# Altium project STM_BLUEPILL.PrjPcb
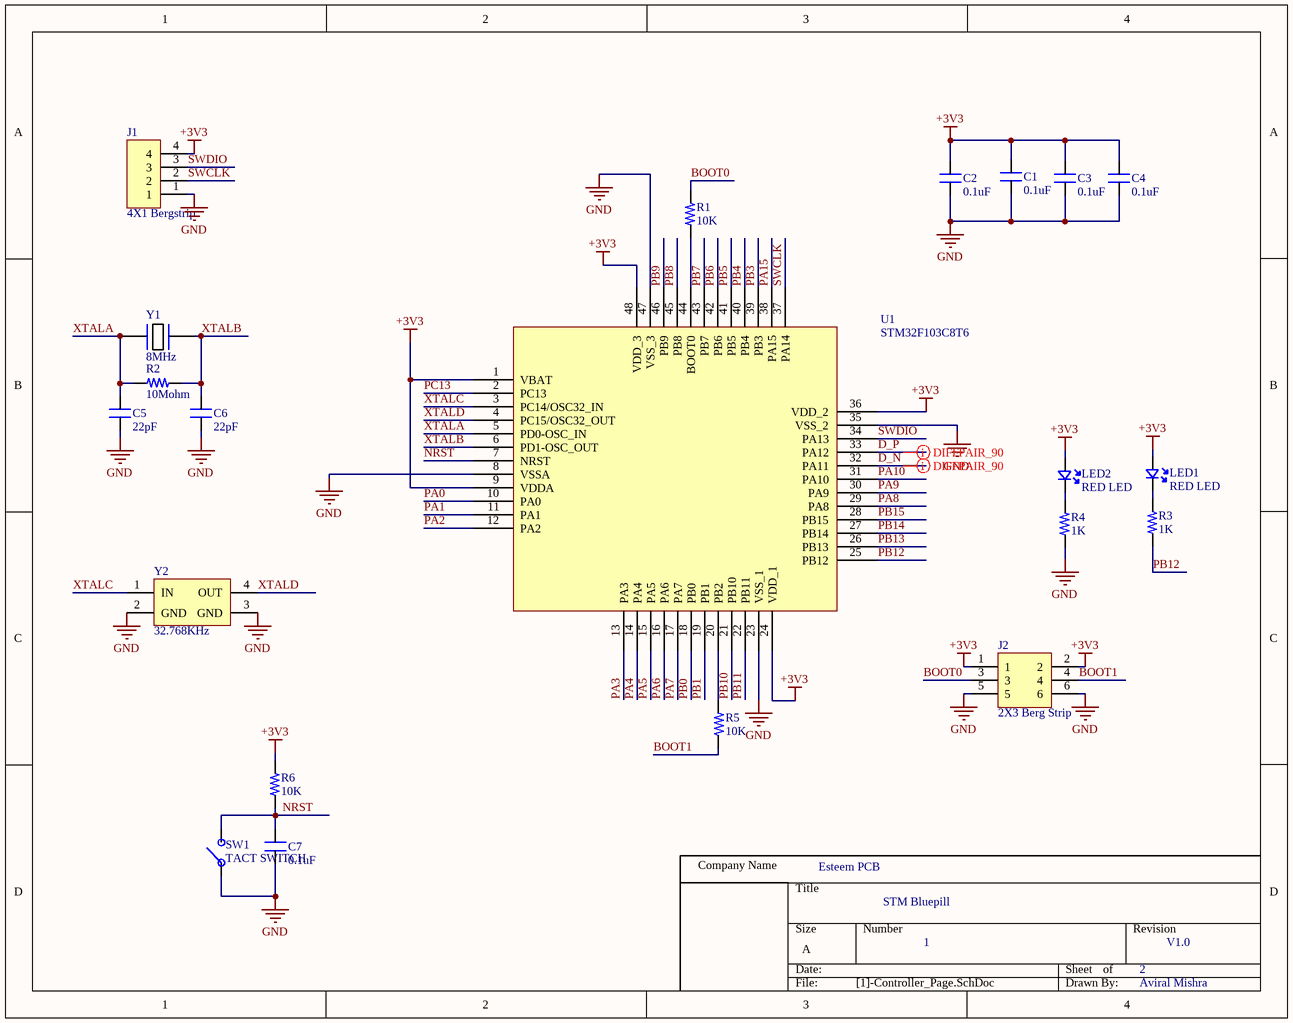
[diagram p0: [1]-Controller_Page.SchDoc]
2 sheets, 30 parts. Net scope: global (net labels, ports and power ports of the same name join across sheets).
Board file: STM_BLUEPILL.PcbDoc
Sheets:
  [1]-Controller_Page.SchDoc
  [2]- Connector_Page.SchDoc

## Sheet [1]-Controller_Page.SchDoc: STM Bluepill
size A; DrawnBy: Aviral Mishra; DocumentNumber: 1; Revision: V1.0; SheetNumber: 1; SheetTotal: 2; Company Name: Esteem PCB

### Parts
C1  0.1uF  [CAP_0805]
C2  0.1uF  [CAP_0805]
C3  0.1uF  [CAP_0805]
C4  0.1uF  [CAP_0805]
C5  22pF  [CAP_0805]
C6  22pF  [CAP_0805]
C7  0.1uF  [CAP_0805]
J1  4X1 Bergstrip  [CON4_100_40D72_TH_ST_MALE]
J2  2X3 Berg Strip  [CON6_100_59D78_TH_ST_Duplicate]
LED1  RED LED  [LED_0805]
LED2  RED LED  [LED_0805]
R1  10K  [RES_0805]
R2  10Mohm  [RES_0805]
R3  1K  [RES_0805]
R4  1K  [RES_0805]
R5  10K  [RES_0805]
R6  10K  [RES_0805]
SW1  TACT SWITCH  [SW_342_SMD]
U1  STM32F103C8T6  [LQFP-48_19.6_393_58X11_SMD]
Y1  8MHz  [XTAL_314_240X47_SMD]
Y2  32.768KHz  [XTAL_MC-405 32.7680K-G3]

### Nets
+3V3: C1.2 C2.2 C3.2 C4.2 J1.4 J2.1 J2.2 LED1.A LED2.A R6.2 U1.1(VBAT) U1.9(VDDA) U1.24(VDD_1) U1.36(VDD_2) U1.48(VDD_3)
GND: C1.1 C2.1 C3.1 C4.1 C5.1 C6.1 C7.1 J1.1 J2.5 J2.6 R4.1 SW1.1 U1.8(VSSA) U1.23(VSS_1) U1.35(VSS_2) U1.47(VSS_3) Y2.2(GND) Y2.3(GND)
BOOT0: J2.3 R1.2
BOOT1: J2.4 R5.2
D_N: U1.32(PA11)
D_P: U1.33(PA12)
NRST: C7.2 R6.1 SW1.2 U1.7(NRST)
PA0: U1.10(PA0)
PA1: U1.11(PA1)
PA2: U1.12(PA2)
PA3: U1.13(PA3)
PA4: U1.14(PA4)
PA5: U1.15(PA5)
PA6: U1.16(PA6)
PA7: U1.17(PA7)
PA8: U1.29(PA8)
PA9: U1.30(PA9)
PA10: U1.31(PA10)
PA15: U1.38(PA15)
PB0: U1.18(PB0)
PB1: U1.19(PB1)
PB3: U1.39(PB3)
PB4: U1.40(PB4)
PB5: U1.41(PB5)
PB6: U1.42(PB6)
PB7: U1.43(PB7)
PB8: U1.45(PB8)
PB9: U1.46(PB9)
PB10: U1.21(PB10)
PB11: U1.22(PB11)
PB12: R3.1 U1.25(PB12)
PB13: U1.26(PB13)
PB14: U1.27(PB14)
PB15: U1.28(PB15)
PC13: U1.2(PC13)
SWCLK: J1.2 U1.37(PA14)
SWDIO: J1.3 U1.34(PA13)
XTALA: C5.2 R2.1 U1.5(PD0-OSC_IN) Y1.1
XTALB: C6.2 R2.2 U1.6(PD1-OSC_OUT) Y1.2
XTALC: U1.3(PC14/OSC32_IN) Y2.1(IN)
XTALD: U1.4(PC15/OSC32_OUT) Y2.4(OUT)
NetLED1_K: LED1.K R3.2
NetLED2_K: LED2.K R4.2
NetR1_1: R1.1 U1.44(BOOT0)
NetR5_1: R5.1 U1.20(PB2)

### Layout directives
differential pair; Diff.Pair Net Class: diff_90: D_N, D_P

### Notes on the sheet
- Company Name

### Library data of the parts
C1-C4 C7 = CAP_0.1uF-50V-5%-0805: 0.1µF ±5% 50V Ceramic Capacitor X7R 0805 (2012 Metric); Manufacturer: KEMET; Manufacturing Part Number: C0805C104J5RACTU; Case/Package: 0805 (2012 Metric); Supplier-1: Digikey; Supplier Part Number-1: 399-1171-1-ND
C5 C6 = CAP_22pF-50V-5%-0805: 22pF ±5% 50V Ceramic Capacitor C0G, NP0 0805 (2012 Metric); Manufacturer: KEMET; Manufacturer Part Number: C0805C220J5GACTU; Case/Package: 0805; Supplier-1: Digikey; Supplier Part Number-1: 399-1113-1-ND
J1 = CON-BS-PLG_4X1-100-TH-ST: 4 pin, 1 row, 2.54mm pitch bergstrip; Manufacturer: NA; Manufacturing Part Number: NA; Case/Package: TH; Supplier-1: NA; Supplier Part Number-1: NA
J2 = CON-BS-PLG_2X3-100-TH-ST: 6 pin, 2 row, 2.54mm pitch bergstrip; Manufacturer: NA; Manufacturer Part Number: NA; Case/Package: TH; Supplier-1: NA; Supplier Part Number-1: NA
LED1 LED2 = LED-RED_10mA-0805: Red 621nm LED Indication - Discrete 2V 0805 (2012 Metric); Manufacturer: Lite-On Inc.; Manufacturer Part Number: LTST-C170EKT; Case/ Package: 0805; Supplier-1: Digikey; Supplier Part Number-1: 160-1178-1-ND
R1 R5 R6 = RES_10K-0.125W-1%-0805: 10 kOhms ±1% 0.125W, 1/8W Chip Resistor 0805 (2012 Metric) Moisture Resistant Thick Film; Manufacturer: Yageo; Manufacturing Part Number: RC0805FR-0710KL; Case/Package: 0805; Supplier-1: Digikey; Supplier Part Number-1: 311-10.0KCRCT-ND
R2 = RES_10MOHM-0.125W-1%-0805: 10 MOhms ±1% 0.125W, 1/8W Chip Resistor 0805 (2012 Metric) Automotive AEC-Q200, High Voltage Thick Film; Manufacturer: Rohm Semiconductor; Manufacturing Part Number: KTR10EZPF1005; Case/Package: 0805 (2012 Metric); Supplier-1: Digikey; Supplier Part Number-1: RHM10.0MAHCT-ND
R3 R4 = RES_1K-0.125W-1%-0805: 1 kOhms ±1% 0.125W, 1/8W Chip Resistor 0805 (2012 Metric) Moisture Resistant Thick Film; Manufacturer: ??á; Manufacturer Part Number: RC0805FR-071KL; Case/Package: 0805; Supplier-1: Digikey; Supplier Part Number-1: 311-1.00KCRCT-ND
SW1 = SW_KSR223GLFG-SMD: Tactile Switch SPST-NO Top Actuated Surface Mount; Manufacturer: C&K; Manufacturing Part Number: KSR223GLFG; Case/Package: SMD; Supplier-1: Digikey; Supplier Part Number-1: 401-1704-1-ND
U1 = IC-STM32F103C8T6 _1: ARM® Cortex®-M3 STM32F1 Microcontroller IC 32-Bit 72MHz 64KB (64K x 8) FLASH; Manufacturer: STMicroelectronics; Manufacturer Part Number: STM32F103C8T6; Case/Package: 48-LQFP; Supplier-1: Digikey; Supplier Part Number-1: 497-6063-ND
Y1 = XTAL_8MHZ-LFXTAL030234: Crystals 8MHz 22pF -20C 70C; Manufacturer: IQD Frequency Products; Manufacturing Part Number: LFXTAL030234Reel; Case/Package: SMD; Supplier-1: Mouser; Supplier Part Number-1: 449-LFXTAL030234REEL
Y2 = XTAL_32.768KHz-MC-405 32.7680K-G3: Crystals SMD AT XTL MHZ +/-50PPM 12.5 PF 250 T/R; Manufacturer: Epson; Manufacturing Part Number: MC-405 32.7680K-G3: ROHS; Case/Package: SMD; Supplier-1: Mouser; Supplier Part Number-1: 732-MC405327680KG3RS

## Sheet [2]- Connector_Page.SchDoc: STM Bluepill
size A; DrawnBy: Aviral Mishra; DocumentNumber: 2; Revision: V1.0; SheetNumber: 2; SheetTotal: 2; Company Name: Esteem PCB
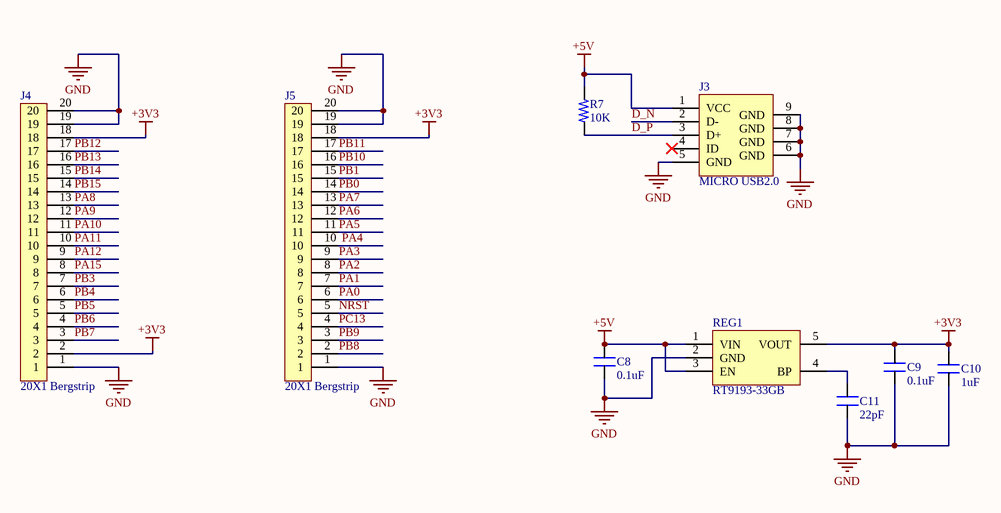
[diagram p1: [2]- Connector_Page.SchDoc]

### Parts
C8  0.1uF  [CAP_0805]
C9  0.1uF  [CAP_0805]
C10  1uF  [CAP_0805]
C11  22pF  [CAP_0805]
J3  MICRO USB2.0  [CON_10118192-0001LF_SMD]
J4  20X1 Bergstrip  [CON20_100_40D72_TH_ST]
J5  20X1 Bergstrip  [CON20_100_40D72_TH_ST]
R7  10K  [RES_0805]
REG1  RT9193-33GB  [SOT23-5]

### Nets
+3V3: C9.2 C10.2 J4.2 J4.18 J5.18 REG1.5(VOUT)
+5V: C8.2 J3.1(VCC) R7.2 REG1.1(VIN) REG1.3(EN)
GND: C8.1 C9.1 C10.1 C11.1 J3.5(GND) J3.6(GND) J3.7(GND) J3.8(GND) J3.9(GND) J4.1 J4.19 J4.20 J5.1 J5.19 J5.20 REG1.2(GND)
D_N: J3.2(D-)
D_P: J3.3(D+) R7.1
NRST: J5.5
PA0: J5.6
PA1: J5.7
PA2: J5.8
PA3: J5.9
PA4: J5.10
PA5: J5.11
PA6: J5.12
PA7: J5.13
PA8: J4.13
PA9: J4.12
PA10: J4.11
PA11: J4.10
PA12: J4.9
PA15: J4.8
PB0: J5.14
PB1: J5.15
PB3: J4.7
PB4: J4.6
PB5: J4.5
PB6: J4.4
PB7: J4.3
PB8: J5.2
PB9: J5.3
PB10: J5.16
PB11: J5.17
PB12: J4.17
PB13: J4.16
PB14: J4.15
PB15: J4.14
PC13: J5.4
NetC11_2: C11.2 REG1.4(BP)

Not connected (* = marked no-connect by the designer): J3 4(ID)*

### Notes on the sheet
- Company Name

### Library data of the parts
C8 C9 = CAP_0.1uF-50V-5%-0805: as C1 on sheet [1]-Controller_Page; Case/Package: 0805 (2012 Metric); Supplier-1: Digikey; Supplier Part Number-1: 399-1171-1-ND
C10 = CAP_1uF-50V-5%-0805: 1µF ±5% 50V Ceramic Capacitor X7R 0805 (2012 Metric); Manufacturer: Yageo; Manufacturing Part Number: CC0805JKX7R9BB105; Case/Package: 0805 (2012 Metric); Supplier-1: Digikey; Supplier Part Number-1: 311-3498-1-ND
C11 = CAP_22pF-50V-5%-0805: as C5 on sheet [1]-Controller_Page; Case/Package: 0805; Supplier-1: Digikey; Supplier Part Number-1: 399-1113-1-ND
J3 = CON-USB_10118192-0002LF-SMD: USB - micro B USB 2.0 Receptacle Connector 5 Position Surface Mount, Right Angle; Manufacturer: Amphenol ICC (FCI); Manufacturing Part Number: 10118192-0002LF; Case/Package: SMD; Supplier-1: Digikey; Supplier Part Number-1: 609-5379-1-ND
J4 J5 = CON-BS-PLG_20X1-100-TH-ST: 20 pin, 1 row, 2.54mm pitch bergstrip; Manufacturer: NA; Manufacturing Part Number: NA; Case/Package: TH; Supplier-1: NA; Supplier Part Number-1: NA
R7 = RES_10K-0.125W-1%-0805: as R1 on sheet [1]-Controller_Page; Case/Package: 0805; Supplier-1: Digikey; Supplier Part Number-1: 311-10.0KCRCT-ND
REG1 = REG_3.3V-5.5V-0.3A-SOT-23-5: Linear Voltage Regulator IC 1 Output 300mA SOT-23-5; Manufacturer: Richtek USA Inc.; Manufacturer Part Number: RT9193-33GB; Case/ Package: SOT-23-5; Supplier-1: Digikey; Supplier Part Number-1: 1028-1014-1-ND

## Nets that join several sheets
+3V3: [1]-Controller_Page (15 pins), [2]- Connector_Page (6 pins)
GND: [1]-Controller_Page (18 pins), [2]- Connector_Page (16 pins)
D_N: [1]-Controller_Page (U1.32), [2]- Connector_Page (J3.2)
D_P: [1]-Controller_Page (U1.33), [2]- Connector_Page (J3.3 R7.1)
NRST: [1]-Controller_Page (C7.2 R6.1 SW1.2 U1.7), [2]- Connector_Page (J5.5)
PA0: [1]-Controller_Page (U1.10), [2]- Connector_Page (J5.6)
PA1: [1]-Controller_Page (U1.11), [2]- Connector_Page (J5.7)
PA2: [1]-Controller_Page (U1.12), [2]- Connector_Page (J5.8)
PA3: [1]-Controller_Page (U1.13), [2]- Connector_Page (J5.9)
PA4: [1]-Controller_Page (U1.14), [2]- Connector_Page (J5.10)
PA5: [1]-Controller_Page (U1.15), [2]- Connector_Page (J5.11)
PA6: [1]-Controller_Page (U1.16), [2]- Connector_Page (J5.12)
PA7: [1]-Controller_Page (U1.17), [2]- Connector_Page (J5.13)
PA8: [1]-Controller_Page (U1.29), [2]- Connector_Page (J4.13)
PA9: [1]-Controller_Page (U1.30), [2]- Connector_Page (J4.12)
PA10: [1]-Controller_Page (U1.31), [2]- Connector_Page (J4.11)
PA15: [1]-Controller_Page (U1.38), [2]- Connector_Page (J4.8)
PB0: [1]-Controller_Page (U1.18), [2]- Connector_Page (J5.14)
PB1: [1]-Controller_Page (U1.19), [2]- Connector_Page (J5.15)
PB3: [1]-Controller_Page (U1.39), [2]- Connector_Page (J4.7)
PB4: [1]-Controller_Page (U1.40), [2]- Connector_Page (J4.6)
PB5: [1]-Controller_Page (U1.41), [2]- Connector_Page (J4.5)
PB6: [1]-Controller_Page (U1.42), [2]- Connector_Page (J4.4)
PB7: [1]-Controller_Page (U1.43), [2]- Connector_Page (J4.3)
PB8: [1]-Controller_Page (U1.45), [2]- Connector_Page (J5.2)
PB9: [1]-Controller_Page (U1.46), [2]- Connector_Page (J5.3)
PB10: [1]-Controller_Page (U1.21), [2]- Connector_Page (J5.16)
PB11: [1]-Controller_Page (U1.22), [2]- Connector_Page (J5.17)
PB12: [1]-Controller_Page (R3.1 U1.25), [2]- Connector_Page (J4.17)
PB13: [1]-Controller_Page (U1.26), [2]- Connector_Page (J4.16)
PB14: [1]-Controller_Page (U1.27), [2]- Connector_Page (J4.15)
PB15: [1]-Controller_Page (U1.28), [2]- Connector_Page (J4.14)
PC13: [1]-Controller_Page (U1.2), [2]- Connector_Page (J5.4)